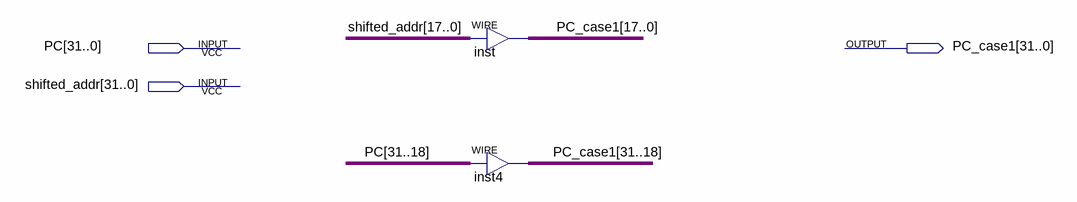
[diagram p0: schematic sheet]
// Quartus schematic PC_case1.bdf as structural Verilog: 2 symbols, 3 pins
module PC_case1 (
  input  [31:0] PC,
  input  [31:0] shifted_addr,
  output [31:0] PC_case1
);

  assign PC_case1[17:0] = shifted_addr[17:0];  // WIRE inst
  assign PC_case1[31:18] = PC[31:18];  // WIRE inst4
endmodule
